# EAGLE design 7seg-2.54-new (EAGLE 7.6.0)
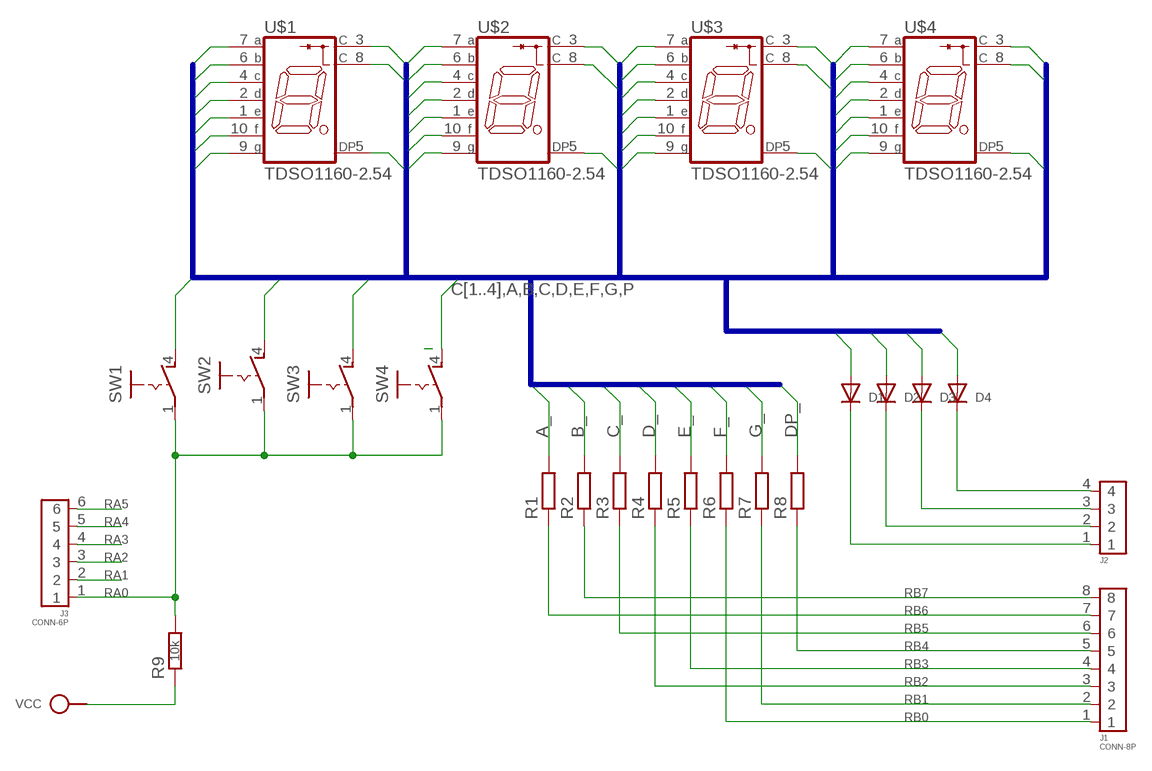
[diagram p0: schematic, sheet 1]

## Parts
D1  1N414834-2,5  [DO34-2,5]
D2  1N414834-2,5  [DO34-2,5]
D3  1N414834-2,5  [DO34-2,5]
D4  1N414834-2,5  [DO34-2,5]
J1  CONN-8P  [CONN-8P]
J2  CONN-4P-4P  [CONN-4P]
J3  CONN-6P  [CONN-6P]
R1  R0202/5-V  [0202/5-V]
R2  R0202/5-V  [0202/5-V]
R3  R0202/5-V  [0202/5-V]
R4  R0202/5-V  [0202/5-V]
R5  R0202/5-V  [0202/5-V]
R6  R0202/5-V  [0202/5-V]
R7  R0202/5-V  [0202/5-V]
R8  R0202/5-V  [0202/5-V]
R9  10k  R0202/5-V  [0202/5-V]
SW1  PB-1P-1T2P1T-2X3  [PB-2P1T-2X3]
SW2  PB-1P-1T2P1T-2X3  [PB-2P1T-2X3]
SW3  PB-1P-1T2P1T-2X3  [PB-2P1T-2X3]
SW4  PB-1P-1T2P1T-2X3  [PB-2P1T-2X3]
U$1  TDSO1160-2.54  [TDSX1150-2.54]
U$2  TDSO1160-2.54  [TDSX1150-2.54]
U$3  TDSO1160-2.54  [TDSX1150-2.54]
U$4  TDSO1160-2.54  [TDSX1150-2.54]
VCC  SPAD  [SPAD]

## Nets
A_: R1.2 U$1.7(A) U$2.7(A) U$3.7(A) U$4.7(A)
B_: R2.2 U$1.6(B) U$2.6(B) U$3.6(B) U$4.6(B)
C1: D1.A SW1.4(S) U$1.3(C) U$1.8(C)
C2: D2.A SW2.4(S) U$2.3(C) U$2.8(C)
C3: D3.A SW3.4(S) U$3.3(C) U$3.8(C)
C4: D4.A SW4.4(S) U$4.3(C) U$4.8(C)
C_: R3.2 U$1.4(C) U$2.4(C) U$3.4(C) U$4.4(C)
D_: R4.2 U$1.2(D) U$2.2(D) U$3.2(D) U$4.2(D)
DP_: R8.2 U$1.5(DP) U$2.5(DP) U$3.5(DP) U$4.5(DP)
E_: R5.2 U$1.1(E) U$2.1(E) U$3.1(E) U$4.1(E)
F_: R6.2 U$1.10(F) U$2.10(F) U$3.10(F) U$4.10(F)
G_: R7.2 U$1.9(G) U$2.9(G) U$3.9(G) U$4.9(G)
N$2: D4.C J2.4
N$4: D3.C J2.3
N$5: D2.C J2.2
N$6: D1.C J2.1
N$7: R9.1 VCC.1
RA0: J3.1 R9.2 SW1.1(P) SW2.1(P) SW3.1(P) SW4.1(P)
RA1: J3.2
RA2: J3.3
RA3: J3.4
RA4: J3.5
RA5: J3.6
RB0: J1.1 R6.1
RB1: J1.2 R7.1
RB2: J1.3 R4.1
RB3: J1.4 R5.1
RB4: J1.5 R8.1
RB5: J1.6 R3.1
RB6: J1.7 R1.1
RB7: J1.8 R2.1

## Buses
C[1..4],A,B,C,D,E,F,G,P

## Library data of the parts
D1-D4 = d:1N4148
J1 = pinconn:CONN-8P
J2 = pinconn:CONN-4P
J3 = pinconn:CONN-6P
R1-R9 = r:R: RESISTOR, European symbol
SW1-SW4 = sw:PB-1P-1T
U$1-U$4 = lcd:TDSO1160
VCC = pad:SPAD

## Board
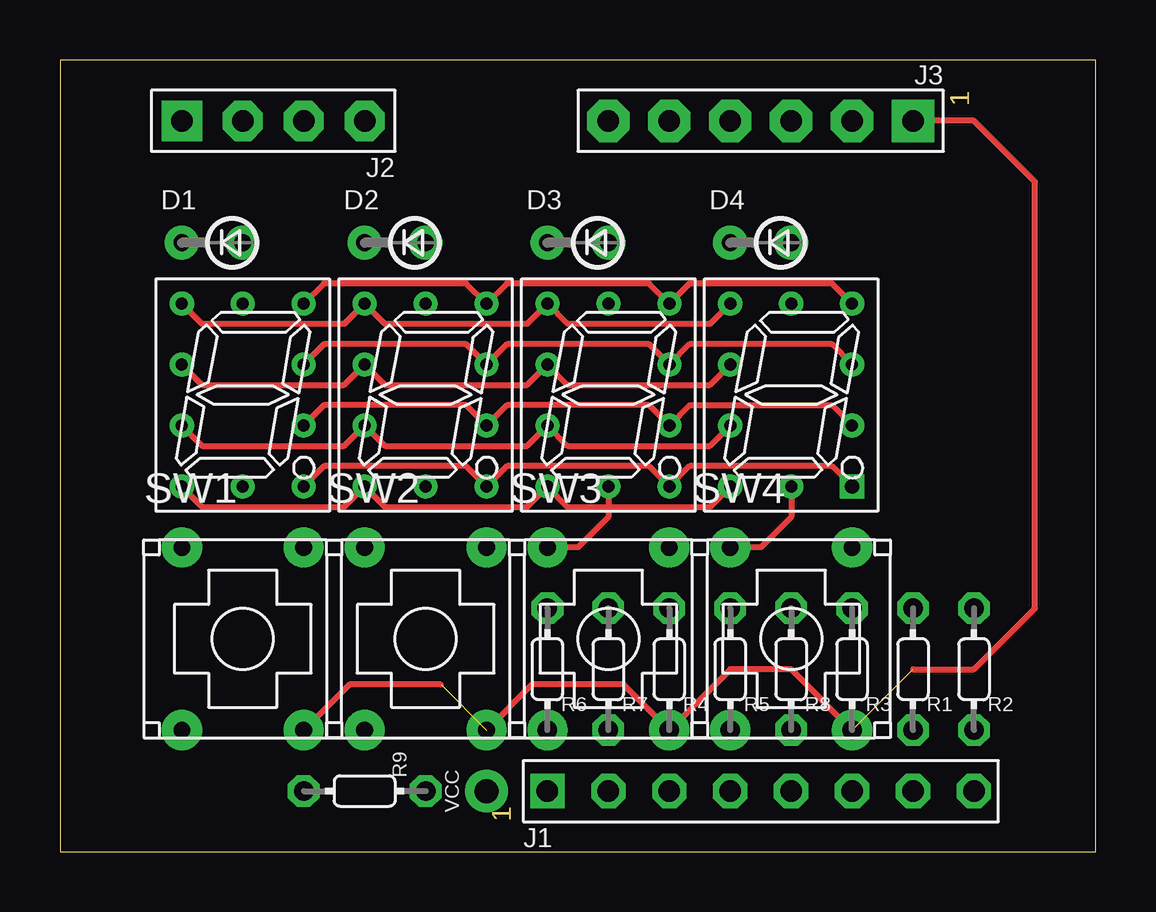
[diagram p1: board, top side]
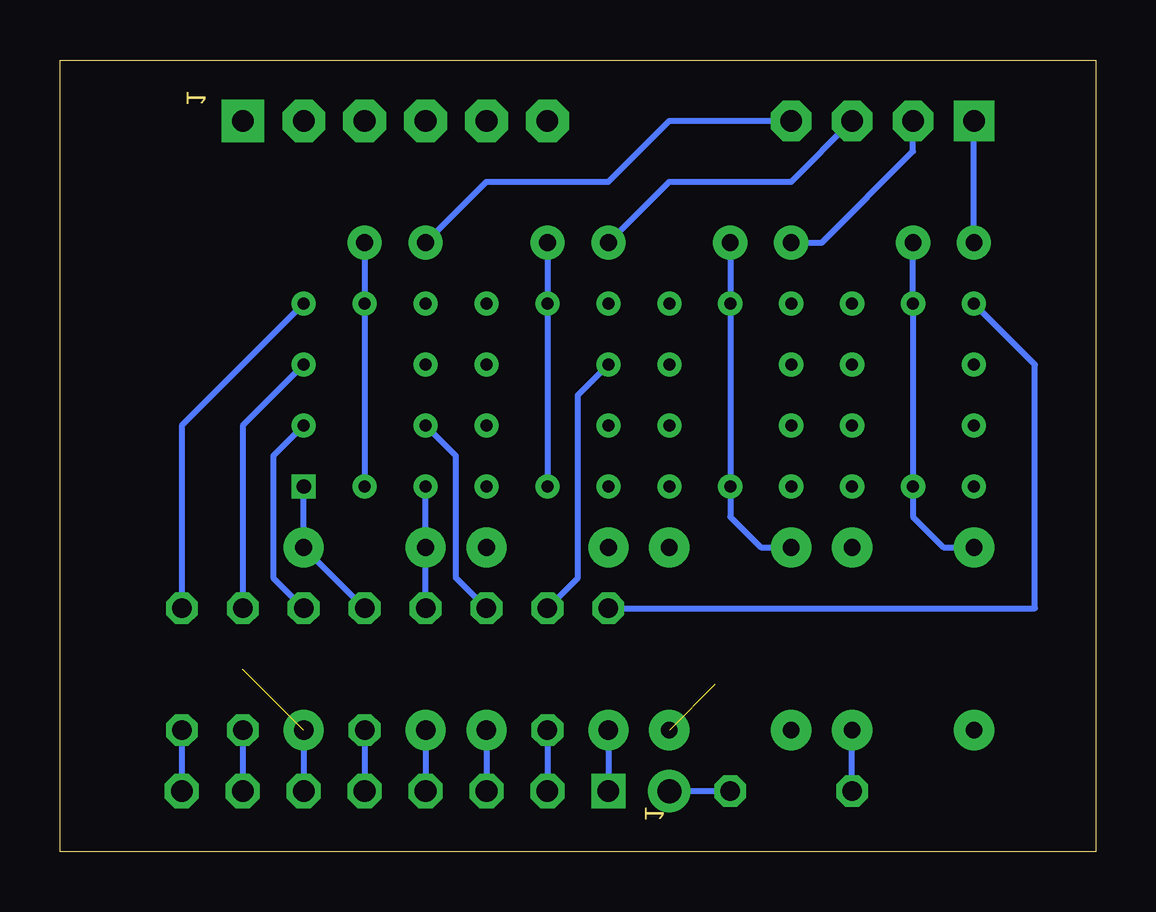
[diagram p2: board, bottom side, seen from below]

Size 43.18 x 33 mm. Coordinates in mm from the lower left corner, seen from the top.
Outline: 0,33 0,0 43.18,0 43.18,33 0,33
Copper layers (1*16): Top 0.035mm / dielectric 1.5mm / Bottom 0.035mm
Design rules "default": minimum track width 10mil, minimum drill 24mil, track to track 8mil, track to pad 8mil, pad to pad 8mil, via to via 8mil, smd to smd 8mil, copper to edge 40mil, drill to drill 8mil, minimum pad ring 10mil, minimum via ring 8mil, stop-mask expansion 4mil, vias tented up to drill 0mil, thermal gap 10mil

### Footprints (pad centres in the part's own frame; a part is rotated, then mirrored left to right if it is on the bottom)
DO34-2,5 = drill 0.7 pad 1.422: A 1.27,0; C -1.27,0
CONN-8P = drill 0.9 pad 1.422 square: 1 -8.89,0 | drill 0.9 pad 1.422 octagon: 2 -6.35,0; 3 -3.81,0; 4 -1.27,0; 5 1.27,0; 6 3.81,0; 7 6.35,0; 8 8.89,0
CONN-4P = drill 0.9 pad 1.676 square: 1 -3.81,0 | drill 0.9 pad 1.676 octagon: 2 -1.27,0; 3 1.27,0; 4 3.81,0
CONN-6P = drill 0.9 pad 1.778 square: 1 -6.35,0 | drill 0.9 pad 1.778 octagon: 2 -3.81,0; 3 -1.27,0; 4 1.27,0; 5 3.81,0; 6 6.35,0
0202/5-V = drill 0.813 octagon: 1 0,2.54; 2 0,-2.54
PB-2P1T-2X3 = drill 0.7 pad 1.676: 1 2.54,-3.81; 2 -2.54,-3.81; 3 2.54,3.81; 4 -2.54,3.81
TDSX1150-2.54 = drill 0.5: 1 -2.54,-3.81; 2 -2.54,-1.27; 3 0,-3.81; 4 2.54,-1.27; 5 2.54,-3.81; 6 2.54,3.81; 7 2.54,1.27; 8 0,3.81; 9 -2.54,1.27; 10 -2.54,3.81
SPAD = drill 1 pad 1.778: 1 0,0

### Placement (x,y rotation side)
D1  6.35,25.38 0 top
D2  13.97,25.38 0 top
D3  21.59,25.38 0 top
D4  29.21,25.38 0 top
J1  29.21,2.52 0 top
J2  8.89,30.46 0 top
J3  29.21,30.46 180 top
R1  35.56,7.6 180 top
R2  38.1,7.6 180 top
R3  33.02,7.6 180 top
R4  25.4,7.6 180 top
R5  27.94,7.6 180 top
R6  20.32,7.6 180 top
R7  22.86,7.6 180 top
R8  30.48,7.6 180 top
R9  12.7,2.52 270 top
SW1  7.62,8.87 0 top
SW2  15.24,8.87 0 top
SW3  22.86,8.87 0 top
SW4  30.48,8.87 0 top
U$1  7.62,19.03 0 top
U$2  15.24,19.03 0 top
U$3  22.86,19.03 0 top
U$4  30.48,19.03 0 top
VCC  17.78,2.52 0 top

### Tracks (layer width: path | path; a pad name or v marks a point on that pad's centre or on a via)
A_
  Top 0.254: U$4.7 32.17,21.15 26.25,21.15 U$3.7 24.55,21.15 18.63,21.15 U$2.7 16.93,21.15 11.01,21.15 U$1.7
  Bottom 0.254: U$4.7 35.56,17.76 R1.2
B_
  Top 0.254: U$4.6 32.17,23.69 26.25,23.69 U$3.6 24.55,23.69 18.63,23.69 U$2.6 16.93,23.69 11.01,23.69 U$1.6
  Bottom 0.254: U$4.6 38.1,17.76 R2.2
C1
  Bottom 0.254: SW1.4 6.35,12.68 7.62,13.95 U$1.3 U$1.8 D1.A
C2
  Bottom 0.254: SW2.4 13.97,12.68 15.24,13.95 U$2.3 U$2.8 D2.A
C3
  Top 0.254: U$3.3 22.86,13.95 21.59,12.68 SW3.4
  Bottom 0.254: U$3.3 U$3.8 D3.A
C4
  Top 0.254: U$4.3 30.48,13.95 29.21,12.68 SW4.4
  Bottom 0.254: U$4.3 U$4.8 D4.A
C_
  Top 0.254: U$4.4 32.17,18.61 26.25,18.61 U$3.4 24.55,18.61 18.63,18.61 U$2.4 16.93,18.61 11.01,18.61 U$1.4
  Bottom 0.254: U$4.4 34.29,16.49 34.29,11.41 R3.2
D_
  Top 0.254: U$1.2 5.93,16.91 11.85,16.91 U$2.2 13.55,16.91 19.47,16.91 U$3.2 21.17,16.91 27.09,16.91 U$4.2
  Bottom 0.254: R4.2 26.67,11.41 26.67,16.49 U$4.2
DP_  (via drill 0.6)
  Top 0.254: U$4.5 32.17,16.07 26.25,16.07 U$3.5 24.55,16.07 18.63,16.07 U$2.5 16.93,16.07 11.01,16.07 U$1.5
  Bottom 0.254: R8.2 33.02,12.68 U$4.5
  other vias: 33.02,15.22
E_
  Top 0.254: U$1.1 5.93,14.37 11.85,14.37 U$2.1 13.55,14.37 19.47,14.37 U$3.1 21.17,14.37 27.09,14.37 U$4.1
  Bottom 0.254: R5.2 U$4.1
F_
  Top 0.254: U$4.10 27.09,21.99 21.17,21.99 U$3.10 19.47,21.99 13.55,21.99 U$2.10 11.85,21.99 5.93,21.99 U$1.10
  Bottom 0.254: R6.2 2.54,10.14 2.54,20.3 U$1.10
G_
  Top 0.254: U$1.9 5.93,19.45 11.85,19.45 U$2.9 13.55,19.45 19.47,19.45 U$3.9 21.17,19.45 27.09,19.45 U$4.9
  Bottom 0.254: R7.2 21.59,11.41 21.59,19.03 U$3.9
N$2
  Bottom 0.254: D4.C 25.4,27.92 20.32,27.92 17.78,30.46 J2.4
N$4
  Bottom 0.254: D3.C 17.78,27.92 12.7,27.92 J2.3
N$5
  Bottom 0.254: D2.C 11.43,25.38 7.62,29.19 J2.2
N$6
  Bottom 0.254: D1.C J2.1
N$7
  Bottom 0.254: R9.1 VCC.1
RA0  (2 unrouted)
  Top 0.254: 15.88,6.97 12.06,6.97 SW1.1 | 35.56,7.6 38.1,7.6 40.64,10.14 40.64,27.92 38.1,30.46 J3.1 | SW2.1 19.68,6.97 23.5,6.97 SW3.1 27.94,7.6 30.48,7.6 SW4.1
  Bottom 0.254: R9.2 SW1.1
RB0
  Bottom 0.254: R6.1 J1.1
RB1
  Bottom 0.254: R7.1 J1.2
RB2
  Bottom 0.254: R4.1 J1.3
RB3
  Bottom 0.254: R5.1 J1.4
RB4
  Bottom 0.254: R8.1 J1.5
RB5
  Bottom 0.254: R3.1 J1.6
RB6
  Bottom 0.254: R1.1 J1.7
RB7
  Bottom 0.254: R2.1 J1.8